# EAGLE design z80 (EAGLE 7.3.0)
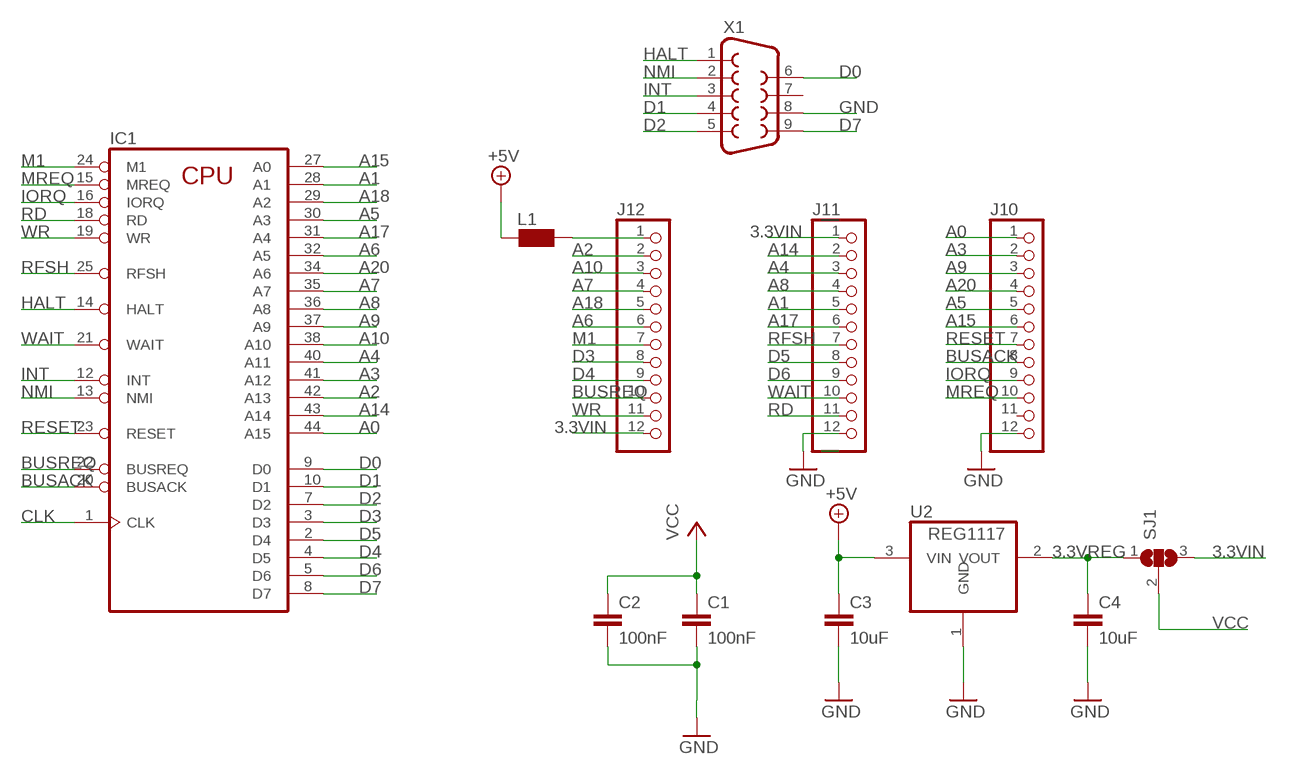
[diagram p0: schematic, sheet 1]

## Parts
C1  100nF  C-EUC0805K  [C0805K]
C2  100nF  C-EUC0805K  [C0805K]
C3  10uF  C-EUC0805K  [C0805K]
C4  10uF  C-EUC0805K  [C0805K]
IC1  Z80CPU-F  [QFP-44]
J10  PINHD-1X12  [1X12]
J11  PINHD-1X12  [1X12]
J12  PINHD-1X12  [1X12]
L1  WE-CBF_0805  [0805]
SJ1  SJ2W  [SJ_2]
U2  REG1117  [SOT223]
X1  F09D  [F09D]

## Nets
3.3VIN [power]: J11.1 J12.12 SJ1.3
3.3VREG [power]: C4.1 SJ1.1 U2.2(VOUT)
+5V [power]: C3.1 L1.2 U2.3(VIN)
A0: IC1.44(A15) J10.1
A1: IC1.28(A1) J11.5
A2: IC1.42(A13) J12.2
A3: IC1.41(A12) J10.2
A4: IC1.40(A11) J11.3
A5: IC1.30(A3) J10.5
A6: IC1.32(A5) J12.6
A7: IC1.35(A7) J12.4
A8: IC1.36(A8) J11.4
A9: IC1.37(A9) J10.3
A10: IC1.38(A10) J12.3
A14: IC1.43(A14) J11.2
A15: IC1.27(A0) J10.6
A17: IC1.31(A4) J11.6
A18: IC1.29(A2) J12.5
A20: IC1.34(A6) J10.4
BUSACK: IC1.20(BUSACK) J10.8
BUSREQ: IC1.22(BUSREQ) J12.10
CLK: IC1.1(CLK)
D0: IC1.9(D0) X1.6
D1: IC1.10(D1) X1.4
D2: IC1.7(D2) X1.5
D3: IC1.3(D3) J12.8
D4: IC1.4(D5) J12.9
D5: IC1.2(D4) J11.8
D6: IC1.5(D6) J11.9
D7: IC1.8(D7) X1.9
GND [power]: C1.2 C2.2 C3.2 C4.2 J10.12 J11.12 U2.1(GND) X1.8
HALT: IC1.14(HALT) X1.1
INT: IC1.12(INT) X1.3
IORQ: IC1.16(IORQ) J10.9
M1: IC1.24(M1) J12.7
MREQ: IC1.15(MREQ) J10.10
N$1 [power]: J12.1 L1.1
NMI: IC1.13(NMI) X1.2
RD: IC1.18(RD) J11.11
RESET: IC1.23(RESET) J10.7
RFSH: IC1.25(RFSH) J11.7
VCC [power]: C1.1 C2.1 SJ1.2
WAIT: IC1.21(WAIT) J11.10
WR: IC1.19(WR) J12.11
Unconnected: IC1.11(NC) IC1.17(NC) IC1.33(NC) IC1.39(NC) J10.11 X1.7

## Power pins joined to a net without a drawn wire
GND: IC1.26(GND)
VCC: IC1.6(VCC)

## Library data of the parts
C1-C4 = rcl:C-EU: CAPACITOR, European symbol
IC1 = Z80FAMIL:Z80CPU-F
J10-J12 = pinhead:PINHD-1X12: PIN HEADER
L1 = wuerth-elektronik:WE-CBF: SMD EMI Suppression Ferrite Beads - excellent anti-EMI properties - low DCR - impedances till 3000 ohms - rated current up to 6 A
SJ1 = jumper:SJ2W: SMD solder JUMPER
U2 = burr-brown:REG1117: 800mA and 1A Low Dropout (LDO) Positive Regulator 1.8V, 2.5V, 2.85V, 3.3V, 5V, and Adj
X1 = con-subd:F09: SUB-D; OC_FARNELL: unknown; OC_NEWARK: unknown

## Net classes
0 default: width 0.203 mm, clearance 0.203 mm
1 power: width 0.406 mm, clearance 0.203 mm to class 0, clearance 0.203 mm

## Board
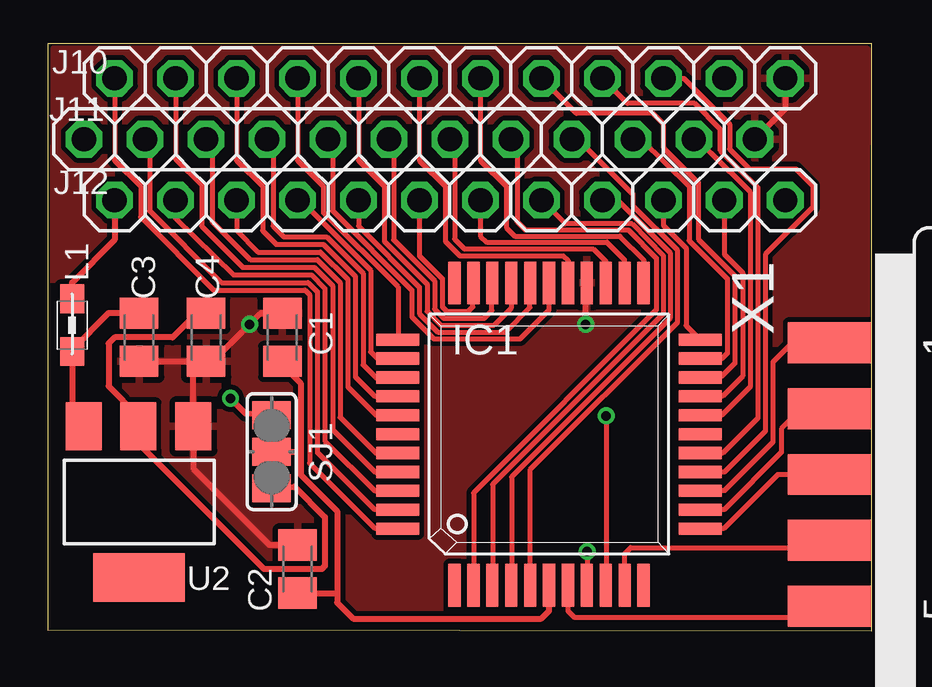
[diagram p1: board, top side]
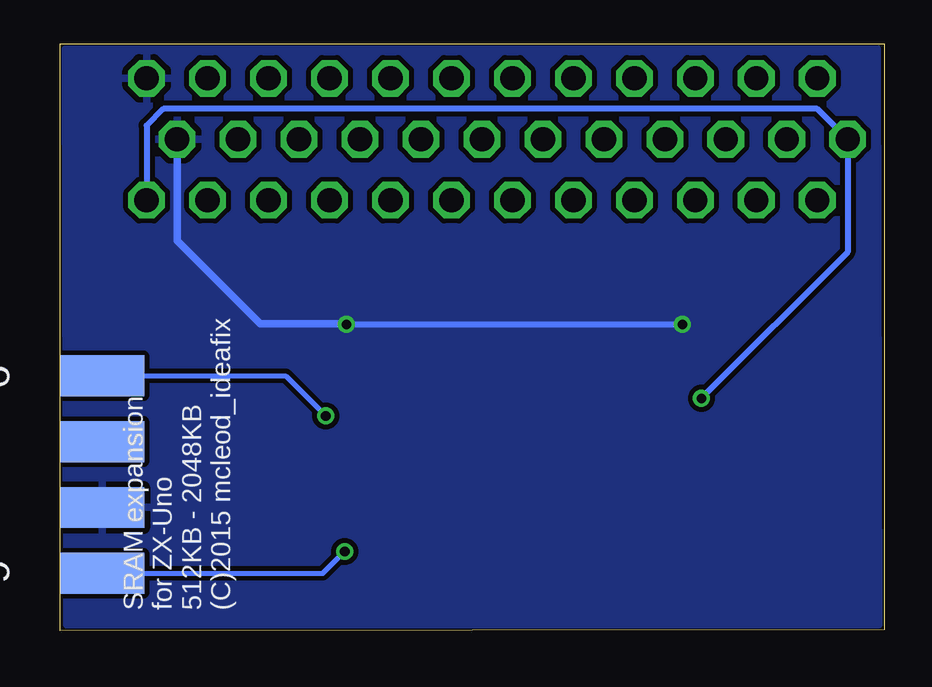
[diagram p2: board, bottom side, seen from below]

No outline drawn. Coordinates in mm, seen from the top.
Copper layers (1*16): Top 0.035mm / dielectric 1.5mm / Bottom 0.035mm
Design rules "seedstudio_Fusion_eagle_rule_v1.1": minimum track width 6mil, minimum drill 12mil, track to track 6mil, track to pad 6mil, pad to pad 6mil, via to via 6mil, smd to smd 0mil, copper to edge 10mil, drill to drill 10mil, minimum pad ring 10mil, minimum via ring 6mil, stop-mask expansion 2mil, vias tented up to drill 100mil, thermal gap 10mil
Milling: 4 lines

### Footprints (pad centres in the part's own frame; a part is rotated, then mirrored left to right if it is on the bottom)
C0805K = smd 1.3 x 1.6: 1 -1,0; 2 1,0
QFP-44 = smd 0.508 x 1.778: 1 -3.937,-6.299; 2 -3.15,-6.299; 3 -2.362,-6.299; 4 -1.575,-6.299; 5 -0.787,-6.299; 6 0,-6.299; 7 0.787,-6.299; 8 1.575,-6.299; 9 2.362,-6.299; 10 3.15,-6.299; 11 3.937,-6.299; 23 3.937,6.299; 24 3.15,6.299; 25 2.362,6.299; 26 1.575,6.299; 27 0.787,6.299; 28 0,6.299; 29 -0.787,6.299; 30 -1.575,6.299; 31 -2.362,6.299; 32 -3.15,6.299; 33 -3.937,6.299 | smd 1.778 x 0.508: 12 6.299,-3.937; 13 6.299,-3.15; 14 6.299,-2.362; 15 6.299,-1.575; 16 6.299,-0.787; 17 6.299,0; 18 6.299,0.787; 19 6.299,1.575; 20 6.299,2.362; 21 6.299,3.15; 22 6.299,3.937; 34 -6.299,3.937; 35 -6.299,3.15; 36 -6.299,2.362; 37 -6.299,1.575; 38 -6.299,0.787; 39 -6.299,0; 40 -6.299,-0.787; 41 -6.299,-1.575; 42 -6.299,-2.362; 43 -6.299,-3.15; 44 -6.299,-3.937
1X12 = drill 1.016 octagon: 1 -13.97,0; 2 -11.43,0; 3 -8.89,0; 4 -6.35,0; 5 -3.81,0; 6 -1.27,0; 7 1.27,0; 8 3.81,0; 9 6.35,0; 10 8.89,0; 11 11.43,0; 12 13.97,0
0805 = smd 1.2 x 1: 1 -1.1,0; 2 1.1,0
SJ_2 = smd 1.168 x 1.6: 1 -1.524,0; 2 0,0; 3 1.524,0
SOT223 = smd 1.499 x 2.007: 1 -2.261,-3.15; 2 0.025,-3.15; 3 2.311,-3.15 | smd 3.81 x 2.007: 4 0,3.15
F09D = smd 1.7 x 3.5: 1 -5.486,-6.045; 2 -2.743,-6.045; 3 0,-6.045; 4 2.743,-6.045; 5 5.486,-6.045 | smd 1.7 x 3.5 bottom: 6 -4.115,-6.045; 7 -1.372,-6.045; 8 1.372,-6.045; 9 4.115,-6.045

### Placement (x,y rotation side)
C1  9.78,12.19 90 top
C2  10.41,2.54 90 top
C3  3.81,12.19 270 top
C4  6.6,12.19 270 top
IC1  20.89,8.16 0 top
J10  16.76,22.99 0 top
J11  15.49,20.45 0 top
J12  16.76,17.91 0 top
L1  1.02,12.7 270 top
SJ1  9.33,7.43 90 top
U2  3.81,5.33 180 top
X1  38.64,6.48 270 top

### Tracks (layer width: path | path; a pad name or v marks a point on that pad's centre or on a via)
3.3VIN  (via drill 0.4)
  Top 0.254: SJ1.3 8.26,9.02 v7.62,9.65
  Bottom 0.254: J12.12 30.73,21.02 30.04,21.72 2.79,21.72 J11.1 1.52,15.75 v7.62,9.65
3.3VREG
  Top 0.254: C4.1 6.21,13.19 5.21,12.19 2.79,12.19 2.54,11.94 2.54,10.16 3.79,8.91 U2.2 3.81,8.46 3.81,7.75 9.02,2.54 11.43,2.54 11.56,2.67 11.56,4.7 10.29,5.97 SJ1.1
+5V
  Top 0.254: C3.1 3.79,13.21 2.54,13.21 1.02,11.68 L1.2 1.02,8.97 U2.3
A0
  Top 0.203: J10.1 2.79,19.56 3.87,18.48 3.87,17.21 6.92,14.16 10.73,14.16 10.92,13.97 10.92,6.95 13.65,4.22 IC1.44
A1
  Top 0.203: J11.5 11.87,20.26 11.87,17.46 15.18,14.16 15.18,13.05 16.1,12.13 19.68,12.13 20.89,13.34 IC1.28
A2
  Top 0.203: J12.2 5.33,17.14 7.75,14.8 10.99,14.8 11.56,14.22 11.56,7.87 13.62,5.81 IC1.42
A3
  Top 0.203: J10.2 5.33,19.62 6.41,18.54 6.41,16.83 8.13,15.11 11.11,15.11 11.87,14.35 11.87,8.35 13.65,6.57 IC1.41
A4
  Top 0.203: J11.3 6.86,20.19 6.86,17.02 8.45,15.43 11.24,15.43 12.19,14.48 12.19,8.86 13.68,7.37 IC1.40
A5
  Top 0.203: J10.5 12.95,19.56 14.03,18.48 14.03,16.19 15.81,14.41 15.81,13.27 16.38,12.7 18.61,12.7 19.32,13.41 IC1.30
A6
  Top 0.203: J12.6 15.49,15.59 16.45,14.64 16.45,13.46 16.64,13.27 17.53,13.27 17.72,13.46 17.72,14.43 IC1.32
A7
  Top 0.203: J12.4 10.54,17.91 13.46,14.99 13.46,11.59 13.75,11.3 IC1.35
A8
  Top 0.203: J11.4 9.21,20.45 9.4,20.26 9.4,16.83 9.84,16.38 11.62,16.38 13.14,14.86 13.14,11.05 13.68,10.51 IC1.36
A9
  Top 0.203: J10.3 7.87,19.56 8.95,18.48 8.95,16.64 9.53,16.07 11.49,16.07 12.83,14.73 12.83,10.54 13.62,9.75 14.58,9.75 IC1.37
A10
  Top 0.203: J12.3 7.87,16.64 8.76,15.75 11.37,15.75 12.51,14.61 12.51,10.13 13.68,8.95 IC1.38
A14
  Top 0.203: J11.2 4.25,20.19 4.25,17.46 7.24,14.48 10.86,14.48 11.24,14.1 11.24,7.4 13.63,5.01 IC1.43
A15
  Top 0.203: J10.6 15.49,19.56 16.57,18.48 16.57,16.19 17.18,15.59 21.5,15.59 21.68,15.4 IC1.27
A17
  Top 0.203: J11.6 14.41,20.26 14.41,16.26 16.13,14.54 16.13,13.37 16.51,12.99 18.19,12.99 18.51,13.3 18.51,14.44 IC1.31
A18
  Top 0.203: IC1.29 20.1,13.43 19.08,12.41 16.26,12.41 15.49,13.18 15.49,14.29 12.95,16.83 J12.5
A20
  Top 0.203: J10.4 10.41,19.56 11.49,18.48 11.49,17.4 14.6,14.29 IC1.34
BUSACK
  Top 0.203: IC1.20 27.21,10.54 28.07,10.54 28.64,11.11 28.64,14.76 27.11,16.29 27.11,18.64 25.65,20.1 25.65,21.11 25.62,21.11 25.21,21.53 22.04,21.53 J10.8
BUSREQ
  Top 0.203: J12.10 25.65,16.86 26.61,15.91 26.61,12.68 IC1.22
D0  (via drill 0.4)
  Top 0.203: v23.27,8.92 23.27,1.88 IC1.9
  Bottom 0.203: X1.6 24.94,10.59 v23.27,8.92
D1
  Top 0.203: IC1.10 24.04,3.18 24.29,3.43 32.29,3.43 X1.4
D2
  Top 0.203: IC1.7 21.68,0.8 21.94,0.54 32.14,0.54 X1.5
D3
  Top 0.203: IC1.3 18.54,1.87 18.54,6.06 25.65,13.18 25.65,15.59 24.35,16.92 21.56,16.92 J12.8
D4
  Top 0.203: J12.9 23.75,17.91 25.94,15.72 25.94,12.99 19.34,6.38 19.34,1.88 IC1.4
D5
  Top 0.203: J11.8 19.56,20.19 19.56,17.02 19.91,16.67 24.19,16.67 25.37,15.49 25.37,13.34 17.75,5.71 IC1.2
D6
  Top 0.203: IC1.5 20.1,6.67 26.23,12.79 26.23,15.84 24.38,17.68 24.38,18.16 22.1,20.45 J11.9
D7  (via drill 0.4)
  Top 0.203: v22.48,3.27 22.48,1.87 IC1.8
  Bottom 0.203: X1.9 23.39,2.36 v22.48,3.27
GND  (via drill 0.4)
  Top 0.254: C3.2 6.1,11.19 | 6.1,11.19 C4.2 6.87,11.19 v8.41,12.73 8.89,13.21 8.91,13.19 C1.2 | 6.1,11.19 6.07,11.17 U2.1 6.1,8.46 6.1,6.7 9.26,3.54 C2.2 | J10.12 30.73,21.72 J11.12 | v22.42,12.73 22.45,14.44 IC1.26
  Bottom 0.254: v22.42,12.73 v8.41,12.73
  Bottom 0.305: J11.12 29.46,16.22 26,12.76 22.45,12.76 v22.42,12.73
  pour Bottom: 0.29,24.23 34.13,24.19 34.07,0.22 0.22,0.22
  pour Top: 0.29,24.23 34.13,24.19 34.07,0.22 0.22,0.22
HALT
  Top 0.203: IC1.14 27.2,5.81 28.19,5.81 30.23,7.84 30.23,11.18 31.02,11.97 X1.1
INT
  Top 0.203: X1.3 30.42,6.48 28.16,4.22 IC1.12
IORQ
  Top 0.203: IC1.16 28.13,7.37 29.59,8.83 29.59,18.45 28.04,19.97 28.04,20.86 26.96,21.94 24.16,21.94 J10.9
M1
  Top 0.203: J12.7 18.03,16.41 18.29,16.16 23.3,16.16 24.04,15.43 IC1.24
MREQ
  Top 0.203: IC1.15 27.2,6.57 28.19,6.57 29.91,8.29 29.91,15.65 31.88,17.62 31.88,18.51 31.18,19.21 29.24,19.21 28.42,20.03 28.42,21.08 26.51,22.99 J10.10
N$1
  Top 0.254: L1.1 1.02,14.48 2.79,16.26 J12.1
NMI
  Top 0.203: X1.2 31.41,9.22 30.57,8.38 30.57,7.4 28.19,5.02 IC1.13
RD
  Top 0.203: IC1.18 28.1,8.95 29.27,10.13 29.27,18.26 27.62,19.88 27.05,20.45 J11.11
RESET
  Top 0.203: J10.7 18.03,19.56 19.11,18.48 19.11,16.76 19.46,16.41 23.84,16.41 24.83,15.43 IC1.23
RFSH
  Top 0.203: J11.7 16.95,20.26 16.95,16.29 17.37,15.88 22.73,15.88 23.27,15.34 23.27,14.48 IC1.25
VCC
  Top 0.254: C1.1 9.78,11.05 10.54,10.29 10.54,7.43 | 10.54,7.43 10.54,6.48 12.06,4.95 12.06,1.59 | SJ1.2 10.54,7.43 | 12.06,1.59 12.06,1.14 12.73,0.48 20.57,0.48 20.89,0.79 IC1.6 | C2.1 12.02,1.54 12.06,1.59
WAIT
  Top 0.203: 24.35,20.45 J11.10 24.73,20.45 26.73,18.48 26.73,16.22 28.32,14.64 28.32,11.53 28.1,11.3 IC1.21
WR
  Top 0.203: J12.11 28.19,15.65 28.96,14.89 28.96,10.57 28.13,9.75 27.2,9.75 IC1.19

### Text on the board
bNames: SRAM expansion / for ZX-Uno / 512KB - 2048KB / (C)2015 mcleod_ideafix